# EAGLE schematic eBus_RS232_schematic (EAGLE 7.1.0)
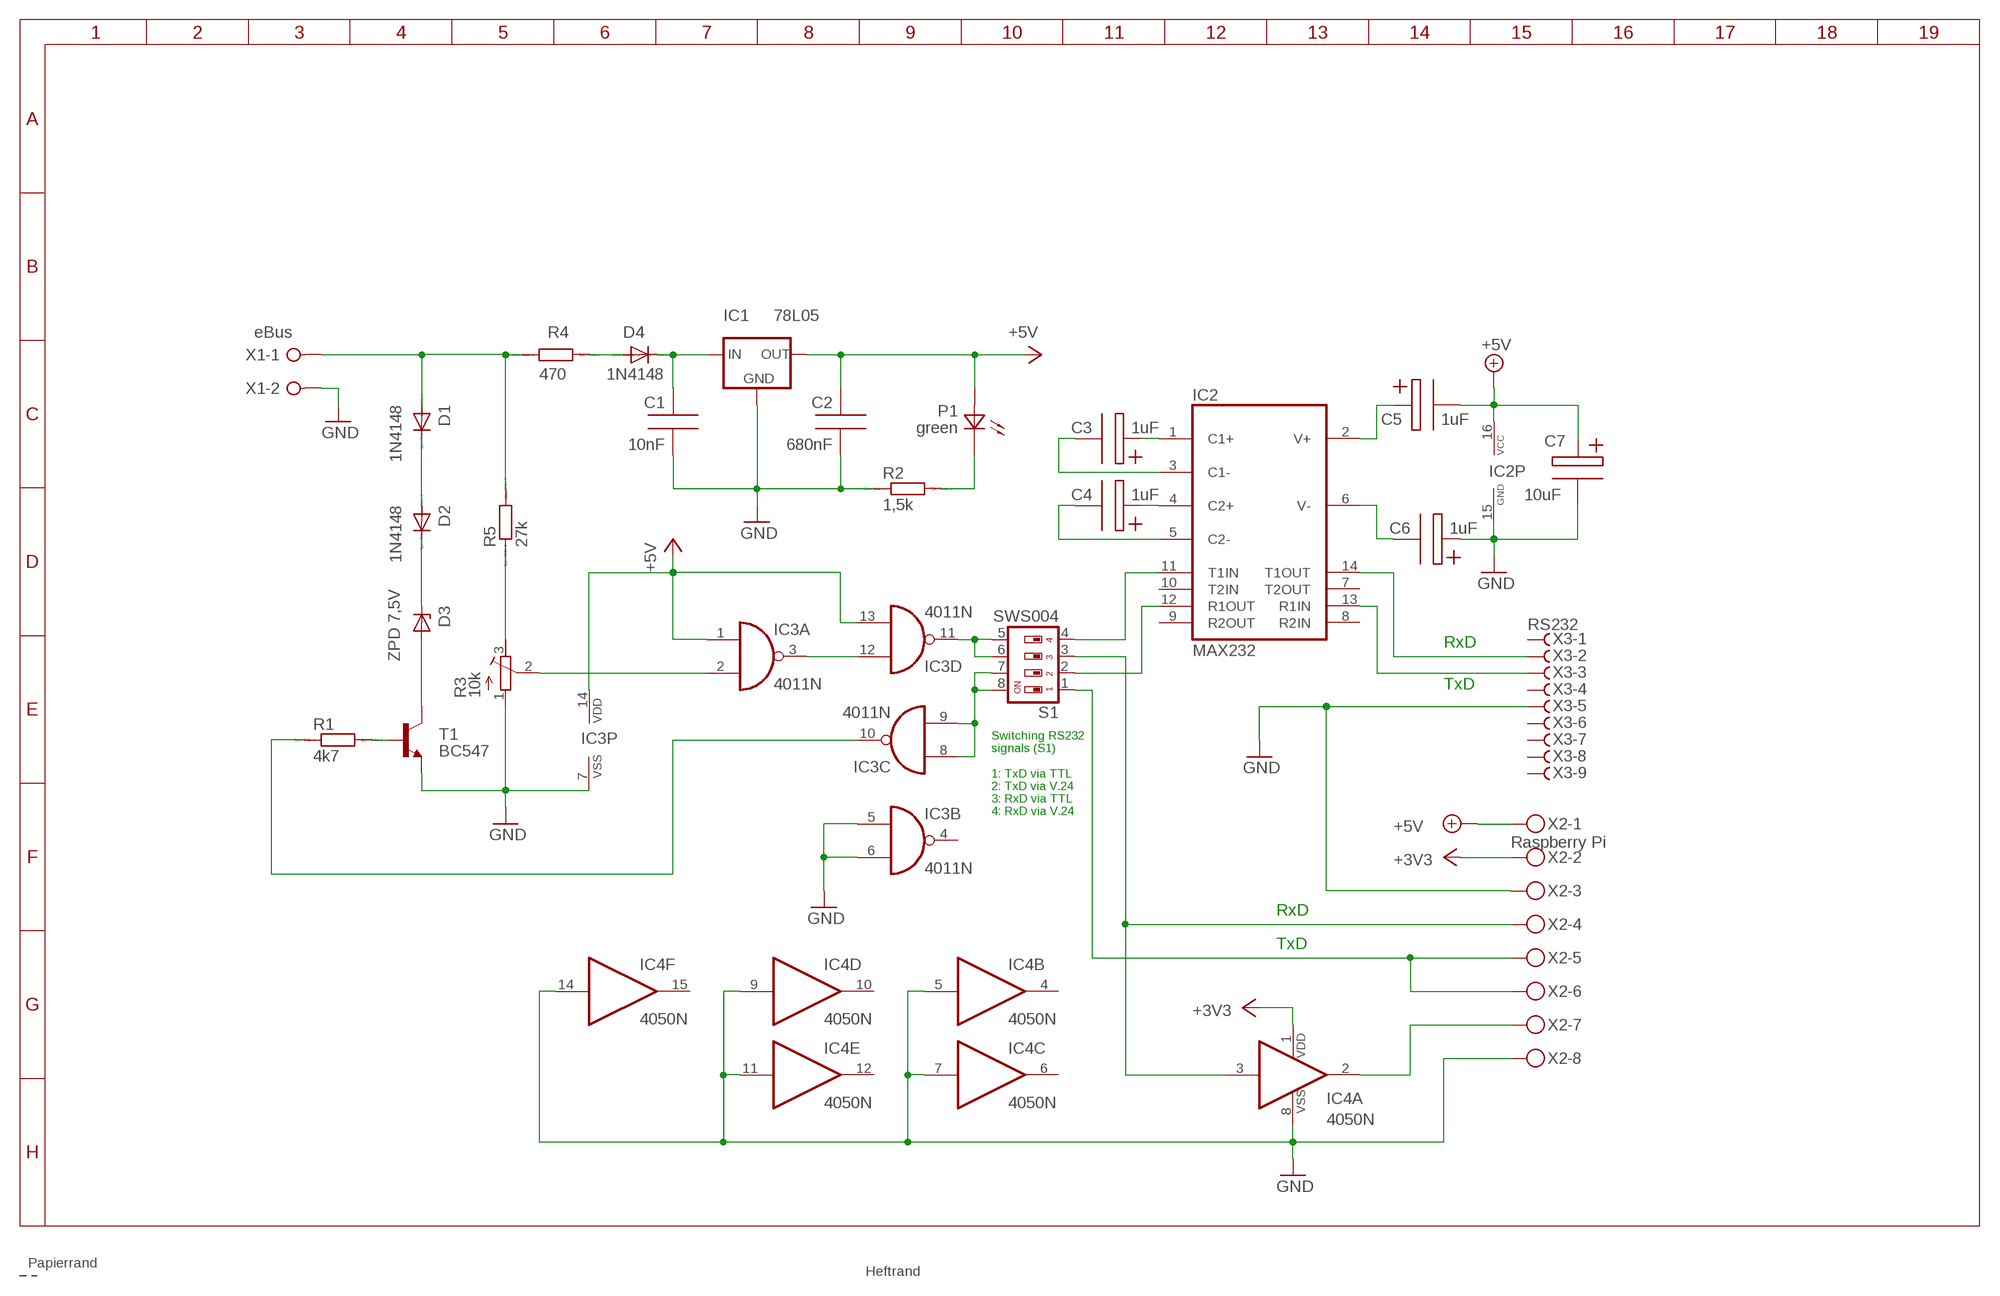
[diagram p0: schematic, sheet 1]

## Parts
C1  10nF  KONDENSATOR_KAPAZITAET_ALLGEMEIN  [KONDENSATOR_KAPAZITAET_ALLGEMEIN]
C2  680nF  KONDENSATOR_KAPAZITAET_ALLGEMEIN  [KONDENSATOR_KAPAZITAET_ALLGEMEIN]
C3  1uF  GEPOLTER_ELEKTROLYTKONDENSATOR  [GEPOLTER_ELEKTROLYTKONDENSATOR]
C4  1uF  GEPOLTER_ELEKTROLYTKONDENSATOR  [GEPOLTER_ELEKTROLYTKONDENSATOR]
C5  1uF  GEPOLTER_ELEKTROLYTKONDENSATOR  [GEPOLTER_ELEKTROLYTKONDENSATOR]
C6  1uF  GEPOLTER_ELEKTROLYTKONDENSATOR  [GEPOLTER_ELEKTROLYTKONDENSATOR]
C7  10uF  GEPOLTER_ELEKTROLYTKONDENSATOR  [GEPOLTER_ELEKTROLYTKONDENSATOR]
D1  1N4148  1N4148DO35-10  [DO35-10]
D2  1N4148  1N4148DO35-10  [DO35-10]
D3  ZPD 7,5V  ZPD  [DO35Z10]
D4  1N4148  1N4148DO35-10  [DO35-10]
IC1  78L05  78LXX  [78LXX]
IC2  MAX232  [DIL16]
IC3  4011N  [DIL14]
IC4  4050N  [DIL16]
P1  green  ANZEIGE_LEUCHTE_LED  [ANZEIGE_LEUCHTE_LED]
R1  4k7  R-EU_0207_10  [0207/10]
R2  1,5k  R-EU_0207_10  [0207/10]
R3  10k  R-TRIMM3339P  [RTRIM3339P]
R4  470  R-EU_0207_10  [0207/10]
R5  27k  R-EU_0207_10  [0207/10]
S1  SWS004  [SMS-004]
T1  BC547  [TO92]
X1  eBus  W237-02P  [W237-132]
X2  Raspberry Pi  MKDSN1,5/8-5,08  [MKDSN1,5/8-5,08]
X3  RS232  F09VS  [F09V]

## Nets
+3V3: IC4.1(P:VDD) X2.2
+5V: C2.1 C5.- C7.+ IC1.OUT IC2.16(VCC) IC3.1(A:I0) IC3.13(D:I1) IC3.14(P:VDD) P1.1(A) X2.1
GND: C1.2 C2.2 C6.+ C7.- IC1.GND IC2.15(GND) IC3.5(B:I0) IC3.6(B:I1) IC3.7(P:VSS) IC4.5(B:I) IC4.7(C:I) IC4.8(P:VSS) IC4.9(D:I) IC4.11(E:I) IC4.14(F:I) R2.1 R3.1(E) T1.1(E) X1.2 X2.3 X2.8 X3.5
N$1: R1.2 T1.2(B)
N$2: D3.A T1.3(C)
N$3: D2.C D3.C
N$4: D1.C D2.A
N$5: D1.A R4.1 R5.2 X1.1
N$6: C5.+ IC2.2(V+)
N$7: C3.+ IC2.1(C1+)
N$8: IC3.2(A:I1) R3.2(S)
N$9: P1.2(C) R2.2
N$10: IC3.3(A:O) IC3.12(D:I0)
N$11: C4.+ IC2.4(C2+)
N$12: C3.- IC2.3(C1-)
N$13: IC3.10(C:O) R1.1
N$14: C4.- IC2.5(C2-)
N$15: C6.- IC2.6(V-)
N$16: IC4.3(A:I) S1.3 X2.4
N$17: S1.1 X2.5 X2.6
N$18: IC2.14(T1OUT) X3.2
N$19: IC2.13(R1IN) X3.3
N$20: C1.1 D4.C IC1.IN
N$21: D4.A R4.2
N$22: IC3.11(D:O) S1.5 S1.6
N$23: IC3.8(C:I0) IC3.9(C:I1) S1.7 S1.8
N$24: IC2.11(T1IN) S1.4
N$25: IC2.12(R1OUT) S1.2
N$26: R3.3(A) R5.1
N$27: IC4.2(A:O) X2.7
Unconnected: IC2.7(T2OUT) IC2.8(R2IN) IC2.9(R2OUT) IC2.10(T2IN) IC3.4(B:O) IC4.4(B:O) IC4.6(C:O) IC4.10(D:O) IC4.12(E:O) IC4.15(F:O) X3.1 X3.4 X3.6 X3.7 X3.8 X3.9

## Notes on the sheet
- RxD
- TxD
- Switching RS232
  signals (S1)
  
  1: TxD via TTL
  2: TxD via V.24
  3: RxD via TTL
  4: RxD via V.24
- RxD
- TxD

## Library data of the parts
C1 C2 = e-kondensatoren:KONDENSATOR_KAPAZITAET_ALLGEMEIN: Kondensator / Kapazität allgemein
C3-C7 = e-kondensatoren:GEPOLTER_ELEKTROLYTKONDENSATOR: Gepolter Elektrolytkondensator
D1 D2 D4 = diode:1N4148: DIODE high speed (Philips)
D3 = diode:ZPD: Z DIODE 500 mW
IC1 = v-reg:78LXX: VOLTAGE REGULATOR
IC2 = maxim:MAX232: RS232 TRANSCEIVER; MF: MAXIM; MPN: MAX232ACPE+; OC_FARNELL: 9723773; OC_NEWARK: 68K4544
IC3 = 40xx:4011: Quad 2-input NAND
IC4 = 40xx:4050: Hex non-inverting BUFFER
P1 = e-lampen-signalisation:ANZEIGE_LEUCHTE_LED: LED-Anzeigeleuchte
R1 R2 R4 R5 = resistor:R-EU_: RESISTOR, European symbol; SPICEPREFIX: R
R3 = resistor:R-TRIMM: Trimm resistor
S1 = smd-special:SWS004: SMD Dip Switch 4 pol.
T1 = transistor-neu-to92:BC547: NPN TRANSISTOR
X1 = con-wago-508:W237-02P: WAGO SREW CLAMP; OC_FARNELL: unknown; OC_NEWARK: unknown
X2 = con-phoenix-508:MKDSN1,5/8-5,08: MKDSN 1,5/ 8-5,08 Printklemme Nennstrom: 13,5 A Nennspannung: 250 V Rastermaß: 5,08 mm Polzahl: 8 Anschlussart: Schraubanschluss Montage: Löten Anschlussrichtung Leiter/Platine: 0 ° Artikelnummer: 1729186 Source: http://eshop.phoenixcontact.com .. 1729186.pdf
X3 = con-subd:F09?S: SUB-D; OC_FARNELL: unknown; OC_NEWARK: unknown